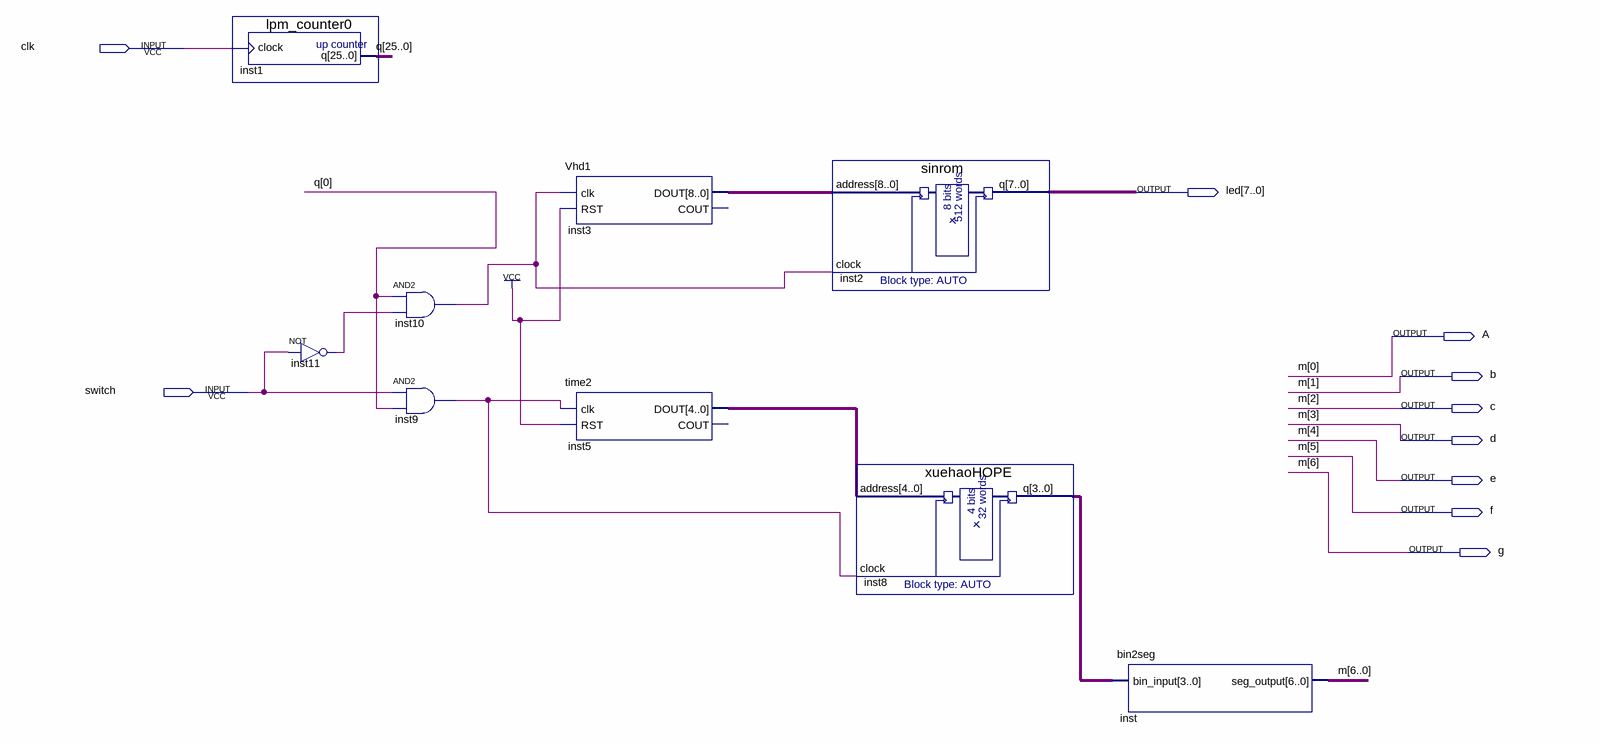
[diagram p0: schematic sheet]
// Quartus schematic db.bdf as structural Verilog: 9 symbols, 10 pins
module db (
  input  clk,
  input  switch,
  output [7:0] led,
  output A,
  output b,
  output c,
  output d,
  output e,
  output f,
  output g
);

  wire inst9_out, inst10_out, inst11_out;
  wire [3:0] inst8_q;
  wire [4:0] inst5_dout;
  wire [8:0] inst3_dout;
  wire [25:0] q;

  lpm_counter0 inst1 (.clock(clk), .q(q));
  not inst11 (inst11_out, switch);
  and inst10 (inst10_out, q[0], inst11_out);
  and inst9 (inst9_out, switch, q[0]);
  Vhd1 inst3 (.clk(inst10_out), .RST(1'b1), .DOUT(inst3_dout));  // open: COUT
  time2 inst5 (.clk(inst9_out), .RST(1'b1), .DOUT(inst5_dout));  // open: COUT
  sinrom inst2 (.address(inst3_dout), .clock(inst10_out), .q(led));
  xuehaoHOPE inst8 (.address(inst5_dout), .clock(inst9_out), .q(inst8_q));
  bin2seg inst (.bin_input(inst8_q), .seg_output({g, f, e, d, c, b, A}));

  // Other names for the same wires on the sheet: m[6:0] = {g, f, e, d, c, b, A}
endmodule
